# Altium schematic sheet FPGA.SchDoc
size A3 portrait
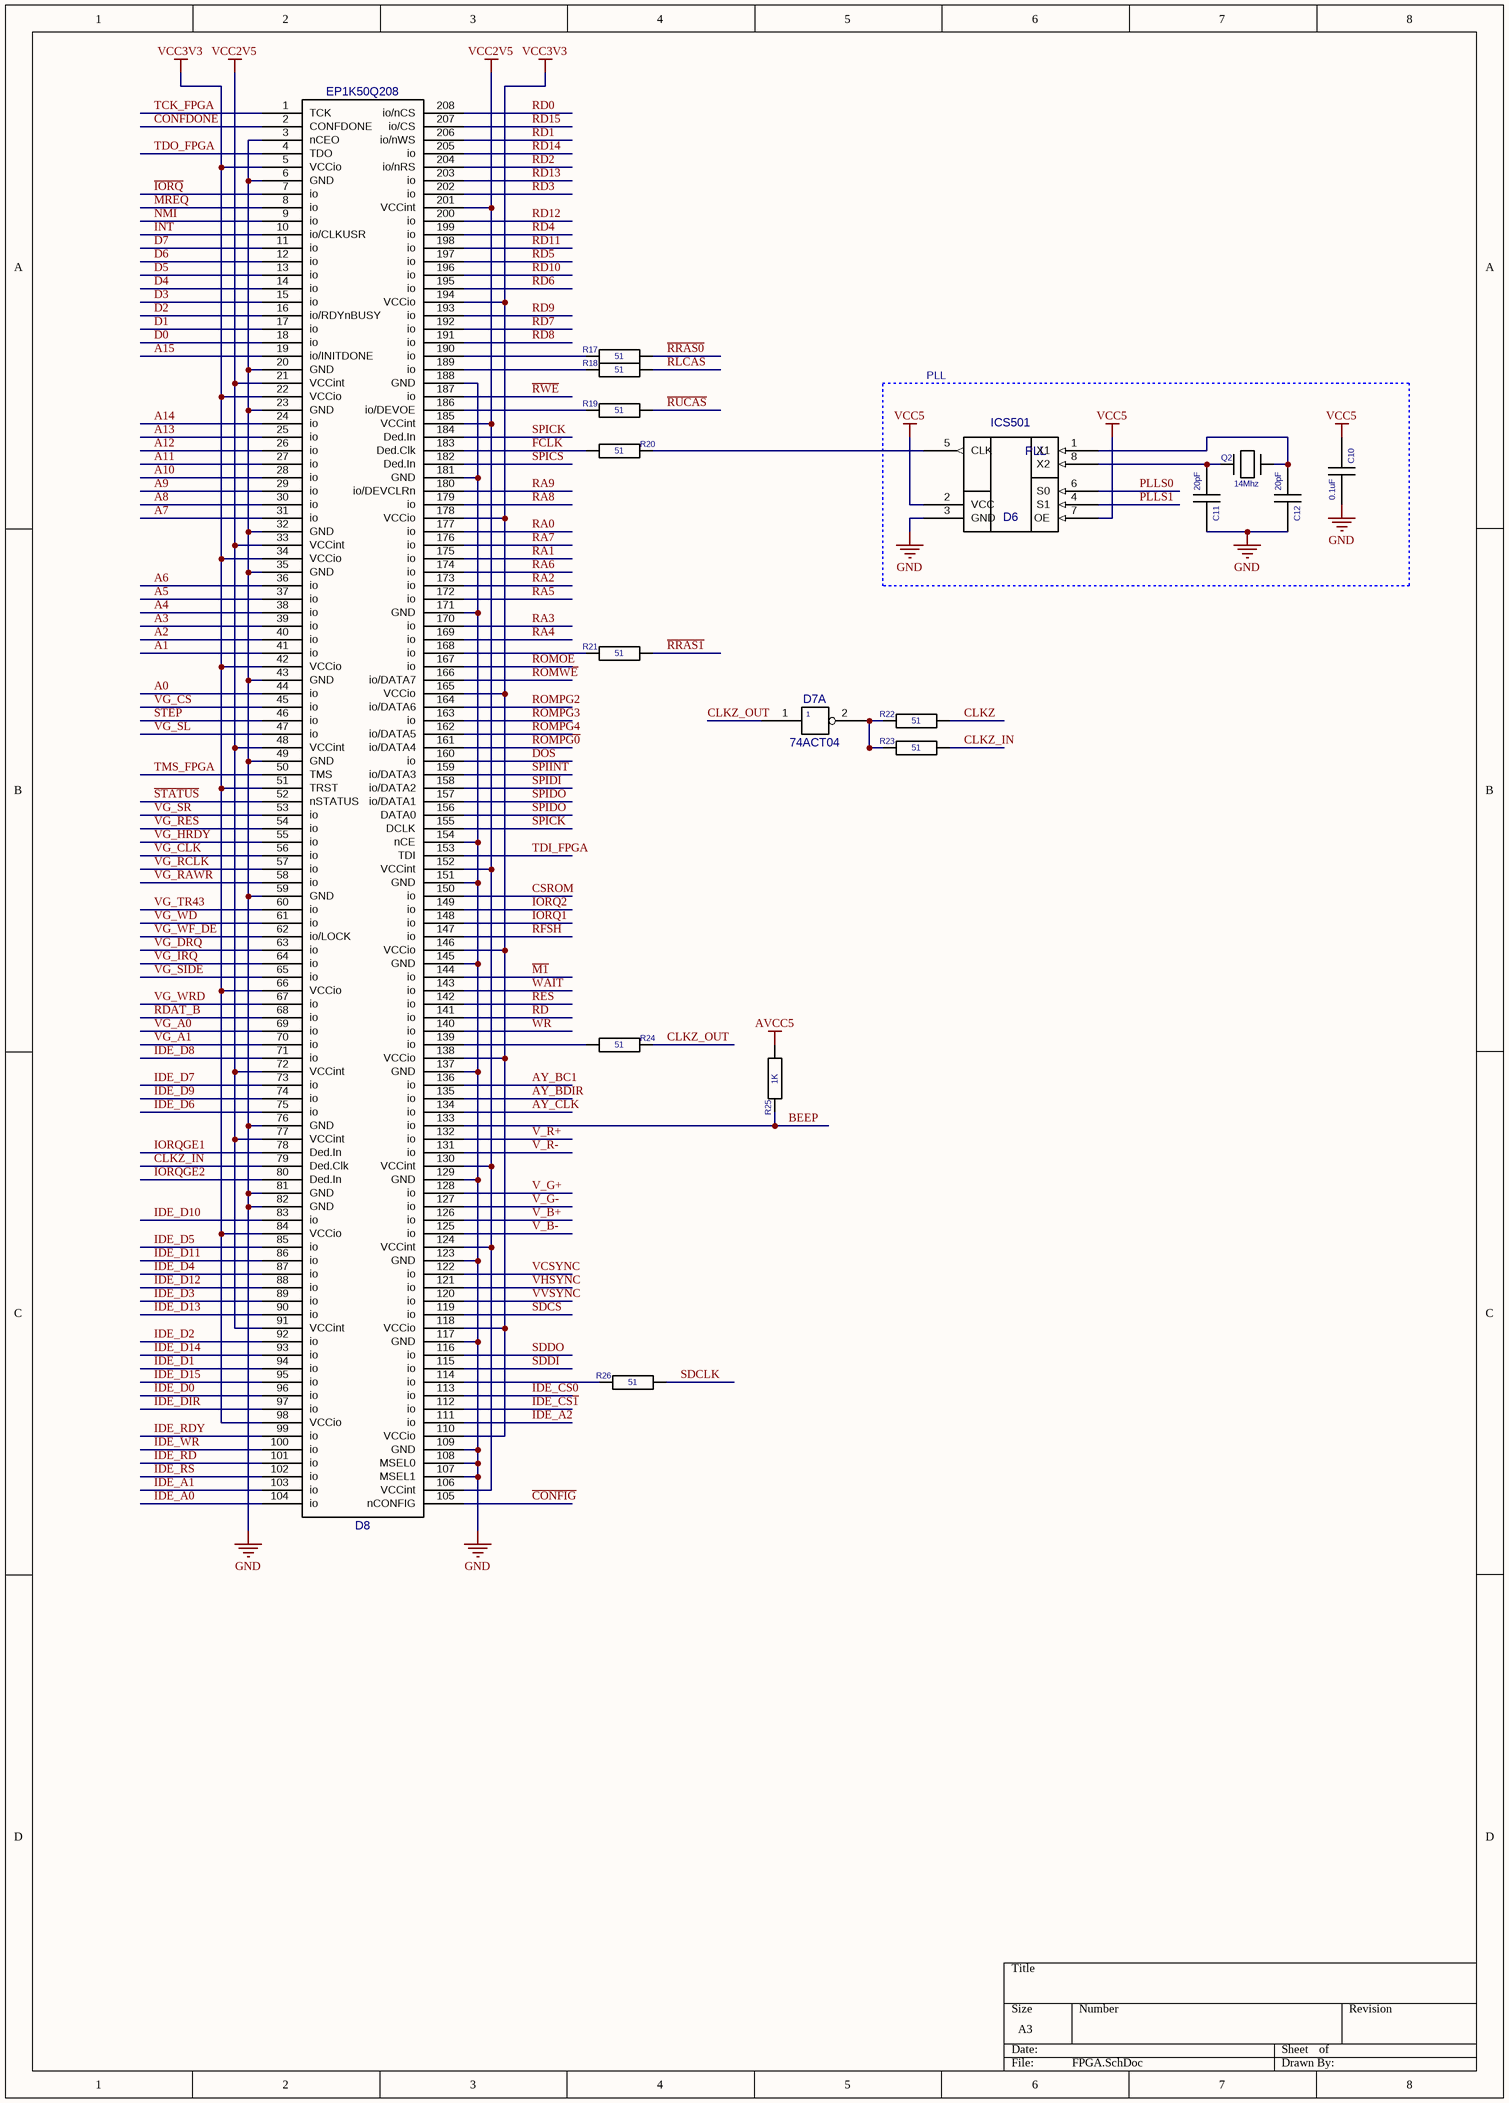
[diagram p0: FPGA.SchDoc]

## Parts
C10  value 0.1uF  [C-CHIP]  (hidden comment: CAPCHIP)
C11  value 20pF  [C-CHIP]  (hidden comment: CAPCHIP)
C12  value 20pF  [C-CHIP]  (hidden comment: CAPCHIP)
D6  ICS501  [SO8]
D7  value 74ACT04  [SO14]  (hidden comment: 04)  (part A of 6)
D8  EP1K50Q208  [PQFP208X5]
Q2  value 14Mhz  [CRYSTAL]  (hidden comment: QUARTZ)
R17  value 51  [R-CHIP]  (hidden comment: RESCHIP)
R18  value 51  [R-CHIP]  (hidden comment: RESCHIP)
R19  value 51  [R-CHIP]  (hidden comment: RESCHIP)
R20  value 51  [R-CHIP]  (hidden comment: RESCHIP)
R21  value 51  [R-CHIP]  (hidden comment: RESCHIP)
R22  value 51  [R-CHIP]  (hidden comment: RESCHIP)
R23  value 51  [R-CHIP]  (hidden comment: RESCHIP)
R24  value 51  [R-CHIP]  (hidden comment: RESCHIP)
R25  value 1K  [R-CHIP]  (hidden comment: RESCHIP)
R26  value 51  [R-CHIP]  (hidden comment: RESCHIP)

## Blocks framed on the sheet
PLL: C10-C12 D6 Q2

## Nets
AVCC5: R25.1(i/o)
GND: C10.2 C11.1 C12.1 D6.3(GND) D7.7(GND) D8.3(nCEO) D8.6(GND) D8.20(GND) D8.23(GND) D8.32(GND) D8.35(GND) D8.43(GND) D8.49(GND) D8.59(GND) D8.76(GND) D8.81(GND) D8.82(GND) D8.107(MSEL1) D8.108(MSEL0) D8.109(GND) D8.117(GND) D8.123(GND) D8.129(GND) D8.137(GND) D8.145(GND) D8.151(GND) D8.154(nCE) D8.171(GND) D8.181(GND) D8.188(GND)
VCC2V5: D8.21(VCCint) D8.33(VCCint) D8.48(VCCint) D8.72(VCCint) D8.77(VCCint) D8.91(VCCint) D8.106(VCCint) D8.124(VCCint) D8.130(VCCint) D8.152(VCCint) D8.185(VCCint) D8.201(VCCint)
VCC3V3: D8.5(VCCio) D8.22(VCCio) D8.34(VCCio) D8.42(VCCio) D8.51(TRST) D8.66(VCCio) D8.84(VCCio) D8.98(VCCio) D8.110(VCCio) D8.118(VCCio) D8.138(VCCio) D8.146(VCCio) D8.165(VCCio) D8.178(VCCio) D8.194(VCCio)
VCC5: C10.1 D6.2(VCC) D6.7(OE) D7.14(+5v)
A0: D8.44(io)
A1: D8.41(io)
A2: D8.40(io)
A3: D8.39(io)
A4: D8.38(io)
A5: D8.37(io)
A6: D8.36(io)
A7: D8.31(io)
A8: D8.30(io)
A9: D8.29(io)
A10: D8.28(io)
A11: D8.27(io)
A12: D8.26(io)
A13: D8.25(io)
A14: D8.24(io)
A15: D8.19(io/INITDONE)
AY_BC1: D8.136(io)
AY_BDIR: D8.135(io)
AY_CLK: D8.134(io)
BEEP: D8.133(io) R25.2(i/o1)
~{CONFIG}: D8.105(nCONFIG)
CLKZ: R22.1(i/o)
CLKZ_IN: D8.79(Ded.Clk) R23.1(i/o)
CLKZ_OUT: D7.1 R24.2(i/o1)
CONFDONE: D8.2(CONFDONE)
CSROM: D8.150(io)
D0: D8.18(io)
D1: D8.17(io)
D2: D8.16(io/RDYnBUSY)
D3: D8.15(io)
D4: D8.14(io)
D5: D8.13(io)
D6: D8.12(io)
D7: D8.11(io)
~{DOS}: D8.160(io)
FCLK: D8.183(Ded.Clk) R20.1(i/o)
~{IDE_CS0}: D8.113(io)
~{IDE_CS1}: D8.112(io)
~{IDE_RD}: D8.101(io)
~{IDE_RS}: D8.102(io)
~{IDE_WR}: D8.100(io)
~{INT}: D8.10(io/CLKUSR)
~{IORQ}: D8.7(io)
~{IORQ1}: D8.148(io)
~{IORQ2}: D8.149(io)
IDE_A0: D8.104(io)
IDE_A1: D8.103(io)
IDE_A2: D8.111(io)
IDE_D0: D8.96(io)
IDE_D1: D8.94(io)
IDE_D2: D8.92(io)
IDE_D3: D8.89(io)
IDE_D4: D8.87(io)
IDE_D5: D8.85(io)
IDE_D6: D8.75(io)
IDE_D7: D8.73(io)
IDE_D8: D8.71(io)
IDE_D9: D8.74(io)
IDE_D10: D8.83(io)
IDE_D11: D8.86(io)
IDE_D12: D8.88(io)
IDE_D13: D8.90(io)
IDE_D14: D8.93(io)
IDE_D15: D8.95(io)
IDE_DIR: D8.97(io)
IDE_RDY: D8.99(io)
IORQGE1: D8.78(Ded.In)
IORQGE2: D8.80(Ded.In)
~{M1}: D8.144(io)
~{MREQ}: D8.8(io)
~{NMI}: D8.9(io)
PLLS0: D6.6(S0)
PLLS1: D6.4(S1)
~{RD}: D8.141(io)
~{RDAT_B}: D8.68(io)
~{RFSH}: D8.147(io)
~{RLCAS}: R18.1(i/o)
~{ROMOE}: D8.167(io)
~{ROMPG0}: D8.161(io/DATA4)
~{ROMWE}: D8.166(io/DATA7)
~{RRAS0}: R17.1(i/o)
~{RRAS1}: R21.1(i/o)
~{RUCAS}: R19.1(i/o)
~{RWE}: D8.187(io)
RA0: D8.177(io)
RA1: D8.175(io)
RA2: D8.173(io)
RA3: D8.170(io)
RA4: D8.169(io)
RA5: D8.172(io)
RA6: D8.174(io)
RA7: D8.176(io)
RA8: D8.179(io)
RA9: D8.180(io/DEVCLRn)
RD0: D8.208(io/nCS)
RD1: D8.206(io/nWS)
RD2: D8.204(io/nRS)
RD3: D8.202(io)
RD4: D8.199(io)
RD5: D8.197(io)
RD6: D8.195(io)
RD7: D8.192(io)
RD8: D8.191(io)
RD9: D8.193(io)
RD10: D8.196(io)
RD11: D8.198(io)
RD12: D8.200(io)
RD13: D8.203(io)
RD14: D8.205(io)
RD15: D8.207(io/CS)
RES: D8.142(io)
ROMPG2: D8.164(io/DATA6)
ROMPG3: D8.163(io)
ROMPG4: D8.162(io/DATA5)
~{SDCS}: D8.119(io)
~{SPICS}: D8.182(Ded.In)
~{SPIINT}: D8.159(io/DATA3)
~{STATUS}: D8.52(nSTATUS)
SDCLK: R26.1(i/o)
SDDI: D8.115(io)
SDDO: D8.116(io)
SPICK: D8.155(DCLK) D8.184(Ded.In)
SPIDI: D8.158(io/DATA2)
SPIDO: D8.156(DATA0) D8.157(io/DATA1)
STEP: D8.46(io)
TCK_FPGA: D8.1(TCK)
TDI_FPGA: D8.153(TDI)
TDO_FPGA: D8.4(TDO)
TMS_FPGA: D8.50(TMS)
~{VG_CS}: D8.45(io)
~{VG_RES}: D8.54(io)
V_B+: D8.126(io)
V_B-: D8.125(io)
V_G+: D8.128(io)
V_G-: D8.127(io)
V_R+: D8.132(io)
V_R-: D8.131(io)
VCSYNC: D8.122(io)
VG_A0: D8.69(io)
VG_A1: D8.70(io)
VG_CLK: D8.56(io)
VG_DRQ: D8.63(io)
VG_HRDY: D8.55(io)
VG_IRQ: D8.64(io)
VG_RAWR: D8.58(io)
VG_RCLK: D8.57(io)
VG_SIDE: D8.65(io)
VG_SL: D8.47(io)
VG_SR: D8.53(io)
VG_TR43: D8.60(io)
VG_WD: D8.61(io)
VG_WF_DE: D8.62(io/LOCK)
VG_WRD: D8.67(io)
VHSYNC: D8.121(io)
VVSYNC: D8.120(io)
~{WAIT}: D8.143(io)
~{WR}: D8.140(io)
NetC11_2: C11.2 D6.8(X2) Q2.A
NetC12_2: C12.2 D6.1(X1) Q2.B
NetD6_5: D6.5(CLK) R20.2(i/o1)
NetD7_2: D7.2 R22.2(i/o1) R23.2(i/o1)
NetD8_114: D8.114(io) R26.2(i/o1)
NetD8_139: D8.139(io) R24.1(i/o)
NetD8_168: D8.168(io) R21.2(i/o1)
NetD8_186: D8.186(io/DEVOE) R19.2(i/o1)
NetD8_189: D8.189(io) R18.2(i/o1)
NetD8_190: D8.190(io) R17.2(i/o1)

## Notes on the sheet
- (in symbol ICS501) PLL

## Library data of the parts
Q2 = QUARTZ: Crystal
D6 = ICS501: Value: *
D8 = EP1K50Q208: Value: *